# EasyEDA schematic SCH_Embedded Watch_2023-10-27.json
TITLE: Sheet_1; REV: 1.0; Date: 2023-04-10; Sheet: 1/1; Drawn By: Randle_H; Company: RandleH
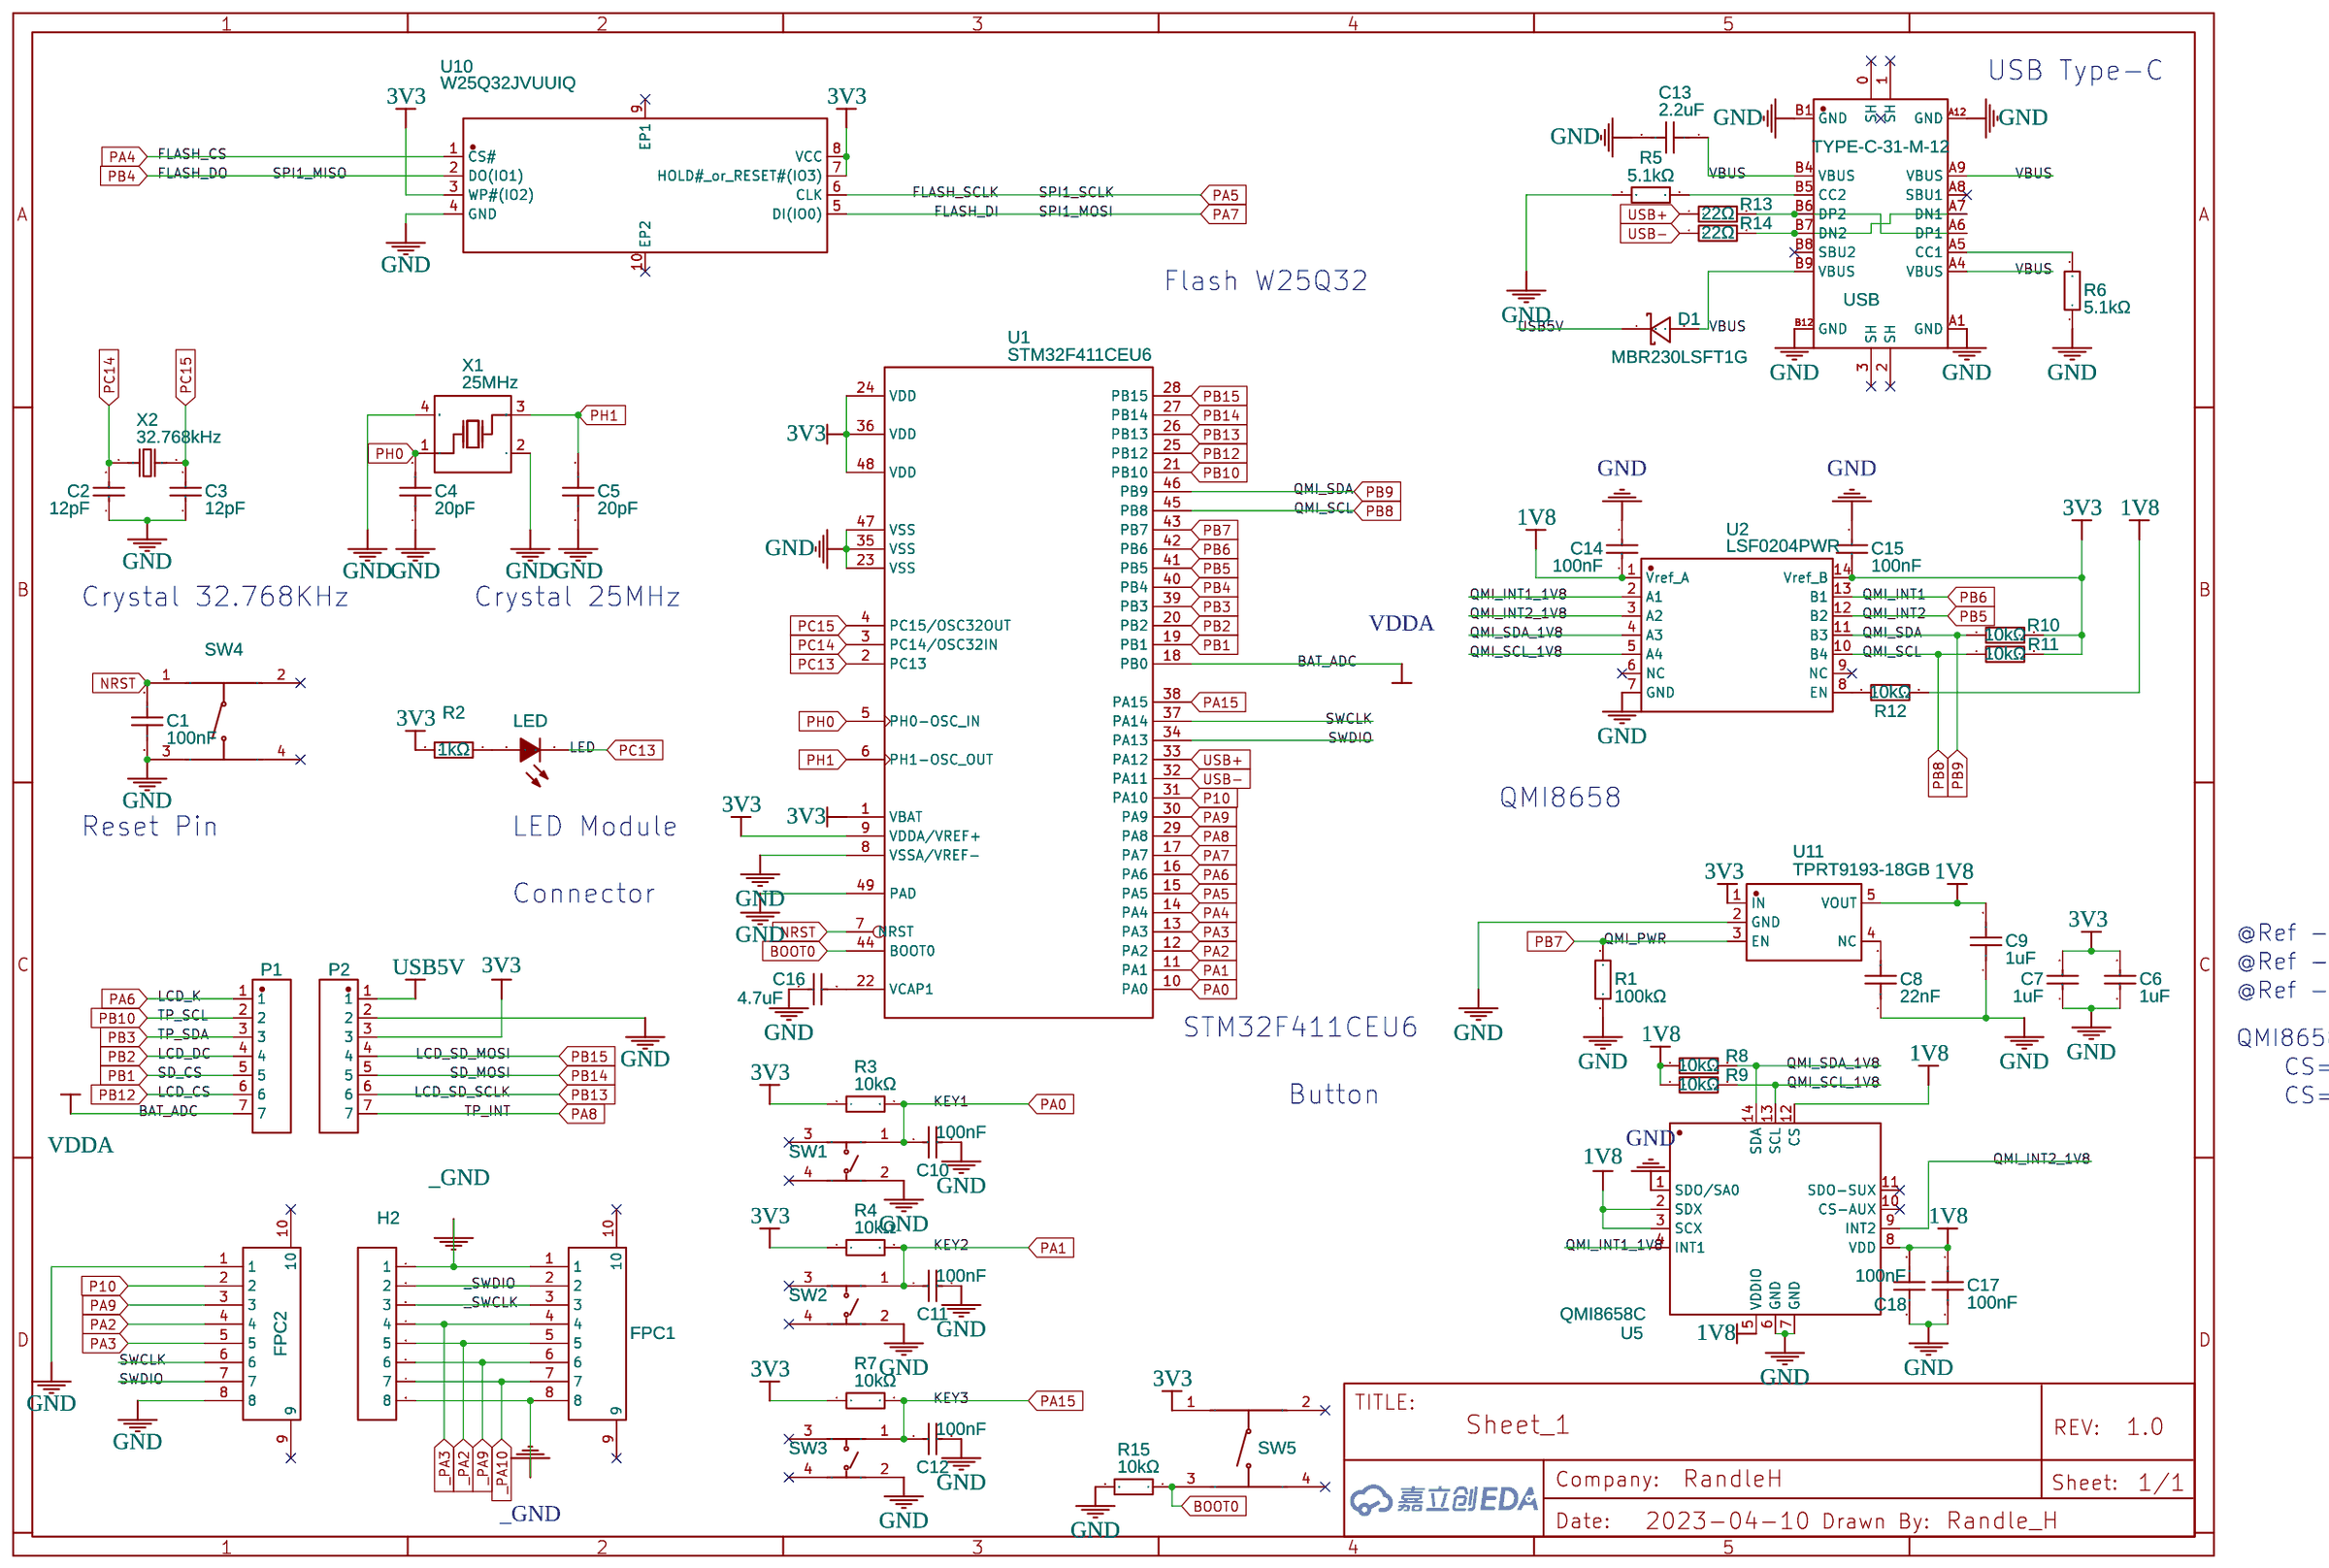
[diagram p0: schematic sheet]

## Parts
C1  100nF  [C0201]
C2  12pF  [C0201]
C3  12pF  [C0201]
C4  20pF  [C0201]
C5  20pF  [C0201]
C6  1uF  [C0201]
C7  1uF  [C0201]
C8  22nF  [C0201]
C9  1uF  [C0201]
C10  100nF  [C0402]
C11  100nF  [C0402]
C12  100nF  [C0402]
C13  2.2uF  [C0805]
C14  100nF  [C0402]
C15  100nF  [C0402]
C16  4.7uF  [C0402]
C17  100nF  [C0201]
C18  100nF  [C0201]
D1  MBR230LSFT1G  [SOD-123FL_L2.7-W1.8-LS3.8-RD]
FPC1  AFC01-S08FCA-00  [FPC-SMD_P0.50-8P_FGS-XJ-H2.0]
FPC2  AFC01-S08FCA-00  [FPC-SMD_P0.50-8P_FGS-XJ-H2.0]
H2  HDR-F-2.54_1x8  [HDR-F-2.54_1X8]
LED  19-213/Y2C-CQ2R2L/3T(CY)  [LED0603-RD-YELLOW]
P1  PM2.54-1*7  [HDR-SMD_7P-P2.54-V-M-LS4.8_R1]
P2  PM2.54-1*7  [HDR-SMD_7P-P2.54-V-M-LS4.8_R1]
R1  100kΩ  [R0402]
R2  1kΩ  [R0402]
R3  10kΩ  [R0402]
R4  10kΩ  [R0402]
R5  5.1kΩ  [R0402]
R6  5.1kΩ  [R0402]
R7  10kΩ  [R0402]
R8  10kΩ  [R0201]
R9  10kΩ  [R0201]
R10  10kΩ  [R0402]
R11  10kΩ  [R0402]
R12  10kΩ  [R0402]
R13  22Ω  [R0402]
R14  22Ω  [R0402]
R15  10kΩ  [R0402]
SW1  EVQPUD02K  [SW-SMD_EVQPUD02K-1]
SW2  EVQPUD02K  [SW-SMD_EVQPUD02K-1]
SW3  EVQPUD02K  [SW-SMD_EVQPUD02K-1]
SW4  PTS830GM140SMTRLFS  [KEY-SMD_4P-L3.0-W2.6-P1.80-LS3.5]
SW5  PTS830GM140SMTRLFS  [KEY-SMD_4P-L3.0-W2.6-P1.80-LS3.5]
U1  STM32F411CEU6  [UFQFPN-48_L7.0-W7.0-P0.50-BL-EP]
U2  LSF0204PWR  [TSSOP-14_L5.0-W4.4-P0.65-LS6.4-BL]
U5  QMI8658C  [LGA-14_L3.0-W2.5-P0.50-BR]
U10  W25Q32JVUUIQ  [USON-8_L4.0-W3.0-P0.80-BL_WINBOND_UU]
U11  TPRT9193-18GB  [SOT-23-5_L3.0-W1.7-P0.95-LS2.8-BL]
USB  TYPE-C-31-M-12  [USB-C_SMD-TYPE-C-31-M-12]
X1  25MHz  [OSC-SMD_4P-L3.2-W2.5-BL]
X2  32.768kHz  [FC-135R_L3.2-W1.5]

## Library data of the parts
C1 = CL05B104KB54PNC: Supplier: LCSC; Supplier Part: C307331; Manufacturer: SAMSUNG(三星); Contributor: LCSC; JLCPCB Part Class: Basic Part
C2 C3 = GRM0335C1H120GA01D: Contributor: LCSC; Supplier: LCSC; Supplier Part: C161404; Manufacturer: muRata(村田); JLCPCB Part Class: Extended Part; link: https://lcsc.com/eda_search?q=C161404&%26type=1&ref=editor
C4 C5 = GRM0335C1H200GA01D: Contributor: LCSC; Supplier: LCSC; Supplier Part: C384973; Manufacturer: muRata(村田); link: https://lcsc.com/eda_search?q=C384973&%26type=1&ref=editor
C6 C7 = GRM033R61A105ME44D: Supplier: LCSC; Manufacturer: muRata(村田); Supplier Part: C76935; JLCPCB Part Class: Extended Part; link: https://lcsc.com/eda_search?q=C76935&%26type=1&ref=editor
C8 = 0201X223K160NT: Contributor: LCSC; Supplier: LCSC; Supplier Part: C285066; Manufacturer: FH(风华); JLCPCB Part Class: Extended Part; link: https://lcsc.com/eda_search?q=C285066&%26type=1&ref=editor
C9 = JMK063ABJ105MP-F: Supplier: LCSC; Manufacturer: TAIYO YUDEN(太诱); Supplier Part: C87143; JLCPCB Part Class: Extended Part; link: https://lcsc.com/eda_search?q=C87143&%26type=1&ref=editor
C10-C12 C14 C15 = CL05B104KO5NNNC: Supplier: LCSC; Manufacturer: SAMSUNG(三星); Supplier Part: C1525; JLCPCB Part Class: Basic Part; link: https://lcsc.com/eda_search?q=C1525&%26type=1&ref=editor
C13 = CL21A225KBQNNNE: Contributor: LCSC; Supplier: LCSC; Supplier Part: C377773; Manufacturer: SAMSUNG(三星); JLCPCB Part Class: Extended Part; link: https://lcsc.com/eda_search?q=C377773&%26type=1&ref=editor
C16 = CL05A475MP5NRNC: Supplier: LCSC; Manufacturer: SAMSUNG(三星); Supplier Part: C23733; JLCPCB Part Class: Basic Part; link: https://lcsc.com/eda_search?q=C23733&%26type=1&ref=editor
C17 C18 = CL03A104KQ3NNNC: Contributor: LCSC; Supplier: LCSC; Manufacturer: SAMSUNG(三星); Supplier Part: C160831; JLCPCB Part Class: Extended Part; link: https://lcsc.com/eda_search?q=C160831&%26type=1&ref=editor
D1 = MBR230LSFT1G: Supplier: LCSC; Manufacturer: onsemi(安森美); Contributor: LCSC; Supplier Part: C126673; JLCPCB Part Class: Extended Part
FPC1 FPC2 = AFC01-S08FCA-00: Contributor: LCSC; Supplier: LCSC; Supplier Part: C262657; Manufacturer: JS(钜硕电子); JLCPCB Part Class: Extended Part; link: https://lcsc.com/eda_search?q=C262657&%26type=1&ref=editor
H2 = HDR-F-2.54_1x8: Supplier Part: C225505; Supplier: LCSC; Contributor: LCEDA_Lib
LED = 19-213/Y2C-CQ2R2L/3T(CY): Supplier: LCSC; Manufacturer: EVERLIGHT(亿光); Supplier Part: C72038; JLCPCB Part Class: Basic Part; link: https://lcsc.com/eda_search?q=C72038&%26type=1&ref=editor
P1 P2 = PM2.54-1*7: Contributor: lcsc; Supplier: LCSC; Supplier Part: C2883804; Manufacturer: XKB Connectivity(中国星坤); Manufacturer Part: X6511WVS-07H-C60D48R1
R1 = 0402WGF1003TCE: Supplier: LCSC; Manufacturer: UNI-ROYAL(厚声); Supplier Part: C25741; JLCPCB Part Class: Basic Part; link: https://lcsc.com/eda_search?q=C25741&%26type=1&ref=editor
R2 = 0402WGF1001TCE: Supplier: LCSC; Manufacturer: UNI-ROYAL(厚声); Supplier Part: C11702; JLCPCB Part Class: Basic Part; link: https://lcsc.com/eda_search?q=C11702&%26type=1&ref=editor
R3 R4 R7 R10-R12 R15 = 0402WGF1002TCE: Supplier: LCSC; Manufacturer: UNI-ROYAL(厚声); Supplier Part: C25744; JLCPCB Part Class: Basic Part; link: https://lcsc.com/eda_search?q=C25744&%26type=1&ref=editor
R5 R6 = 0402WGF5101TCE: Supplier: LCSC; Manufacturer: UNI-ROYAL(厚声); Supplier Part: C25905; JLCPCB Part Class: Basic Part; link: https://lcsc.com/eda_search?q=C25905&%26type=1&ref=editor
R8 R9 = RC0201JR-0710KL: Supplier: LCSC; Manufacturer: YAGEO(国巨); Supplier Part: C138117; JLCPCB Part Class: Extended Part; link: https://lcsc.com/eda_search?q=C138117&%26type=1&ref=editor
R13 R14 = 0402WGF220JTCE: Supplier: LCSC; Manufacturer: UNI-ROYAL(厚声); Supplier Part: C25092; JLCPCB Part Class: Basic Part; link: https://lcsc.com/eda_search?q=C25092&%26type=1&ref=editor
SW1-SW3 = EVQPUD02K: Supplier: LCSC; Supplier Part: C388885; Manufacturer: PANASONIC(松下); Contributor: LCSC; JLCPCB Part Class: Extended Part
SW4 SW5 = PTS830GM140SMTRLFS: Supplier: LCSC; Supplier Part: C221904; Manufacturer: C&K; Contributor: LCSC; JLCPCB Part Class: Extended Part
U1 = STM32F411CEU6: Supplier: LCSC; Manufacturer: ST(意法半导体); Supplier Part: C60420; JLCPCB Part Class: Extended Part
U2 = LSF0204PWR: Supplier: LCSC; Supplier Part: C202288; Manufacturer: TI(德州仪器); Contributor: LCSC; JLCPCB Part Class: Extended Part
U5 = QMI8658C: Supplier: LCSC; Supplier Part: C2842151; Manufacturer: QST(上海矽睿); JLCPCB Part Class: Extended Part; Contributor: LCSC
U10 = W25Q32JVUUIQ: Supplier: LCSC; Supplier Part: C2999380; Manufacturer: WINBOND(华邦); link: https://atta.szlcsc.com/upload/public/pdf/source/20220419/71F2D20BDA1217995CECC027DED216BE.pdf; Contributor: lcsc; JLCPCB Part Class: Extended Part
U11 = TPRT9193-18GB: Supplier: LCSC; Supplier Part: C2835438; Manufacturer: TECH PUBLIC(台舟); Contributor: LCSC; JLCPCB Part Class: Extended Part
USB = TYPE-C-31-M-12: Supplier: LCSC; Supplier Part: C165948; Manufacturer: 韩国韩荣; Contributor: LCSC; JLCPCB Part Class: Extended Part
X1 = SMD-3225_4P25MHZ20PF10PPM-40&#126;+85℃: Supplier: LCSC; Supplier Part: C164045; Manufacturer: TAE(雅晶鑫); Manufacturer Part: TAXM25M4RLBCCT2T; Contributor: LCSC; JLCPCB Part Class: Extended Part
X2 = Q13FC1350000400: Supplier: LCSC; Manufacturer: EPSON(爱普生); Supplier Part: C32346; JLCPCB Part Class: Basic Part; link: https://lcsc.com/eda_search?q=C32346&%26type=1&ref=editor

## Nets
1V8: C9.2 C14.1 C17.1 C18.1 R8.1 R9.1 R12.2 U2.1(Vref_A) U5.2(SDX) U5.3(SCX) U5.5(VDDIO) U5.8(VDD) U5.12(CS) U11.5(VOUT)
3V3: C6.2 C7.2 C15.1 P2.3 R2.1 R3.1 R4.1 R7.1 R10.2 R11.2 SW5.1 U1.1(VBAT) U1.9(VDDA/VREF+) U1.24(VDD) U1.36(VDD) U1.48(VDD) U2.14(Vref_B) U10.3(WP#(IO2)) U10.7(HOLD# or RESET#(IO3)) U10.8(VCC) U11.1(IN)
GND: C1.1 C2.1 C3.1 C4.1 C5.1 C6.1 C7.1 C8.1 C9.1 C10.2 C11.2 C12.2 C13.2 C14.2 C15.2 C16.1 C17.2 C18.2 FPC2.1 FPC2.8 P2.2 R1.1 R5.2 R6.1 R15.2 SW1.2 SW2.2 SW3.2 SW4.3 U1.8(VSSA/VREF-) U1.23(VSS) U1.35(VSS) U1.47(VSS) U1.49(PAD) U2.7(GND) U5.1(SDO/SA0) U5.6(GND) U5.7(GND) U10.4(GND) U11.2(GND) USB.A1(GND) USB.A12(GND) USB.B1(GND) USB.B12(GND) X1.2(GND) X1.4(GND)
VBUS: C13.1 D1.2(A) USB.A4(VBUS) USB.A9(VBUS) USB.B4(VBUS) USB.B9(VBUS)
_GND: FPC1.1 FPC1.8 H2.1 H2.8
_PA2: FPC1.5 H2.5
_PA3: FPC1.4 H2.4
_PA9: FPC1.6 H2.6
_PA10: FPC1.7 H2.7
_SWCLK: FPC1.3 H2.3
_SWDIO: FPC1.2 H2.2
BAT_ADC: P1.7 U1.18(PB0)
BOOT0: R15.1 SW5.3 U1.44(BOOT0)
FLASH_CS: U1.14(PA4) U10.1(CS#)
FLASH_DI: U1.17(PA7) U10.5(DI(IO0))
FLASH_DO: U1.40(PB4) U10.2(DO(IO1))
FLASH_SCLK: U1.15(PA5) U10.6(CLK)
KEY1: C10.1 R3.2 SW1.1 U1.10(PA0)
KEY2: C11.1 R4.2 SW2.1 U1.11(PA1)
KEY3: C12.1 R7.2 SW3.1 U1.38(PA15)
LCD_CS: P1.6 U1.25(PB12)
LCD_DC: P1.4 U1.20(PB2)
LCD_K: P1.1 U1.16(PA6)
LCD_SD_MOSI: P2.4 U1.28(PB15)
LCD_SD_SCLK: P2.6 U1.26(PB13)
LED: LED.1(C) U1.2(PC13)
NRST: C1.2 SW4.1 U1.7(NRST)
P10: FPC2.2 U1.31(PA10)
PA2: FPC2.4 U1.12(PA2)
PA3: FPC2.5 U1.13(PA3)
PA8: P2.7 U1.29(PA8)
PA9: FPC2.3 U1.30(PA9)
PB1: P1.5 U1.19(PB1)
PB3: P1.3 U1.39(PB3)
PB5: U1.41(PB5) U2.12(B2)
PB6: U1.42(PB6) U2.13(B1)
PB7: R1.2 U1.43(PB7) U11.3(EN)
PB8: R11.1 U1.45(PB8) U2.10(B4)
PB9: R10.1 U1.46(PB9) U2.11(B3)
PB10: P1.2 U1.21(PB10)
PB14: P2.5 U1.27(PB14)
PC14: C2.2 U1.3(PC14/OSC32IN) X2.1
PC15: C3.2 U1.4(PC15/OSC32OUT) X2.2
PH0: C4.2 U1.5(PH0-OSC_IN) X1.1(OSC1)
PH1: C5.2 U1.6(PH1-OSC_OUT) X1.3(OSC2)
QMI_INT1_1V8: U2.2(A1) U5.4(INT1)
QMI_INT2_1V8: U2.3(A2) U5.9(INT2)
QMI_SCL_1V8: R9.2 U2.5(A4) U5.13(SCL)
QMI_SDA_1V8: R8.2 U2.4(A3) U5.14(SDA)
SWCLK: FPC2.6 U1.37(PA14)
SWDIO: FPC2.7 U1.34(PA13)
USB5V: D1.1(C) P2.1
USB+: R13.1 U1.33(PA12)
USB-: R14.1 U1.32(PA11)
Net-(C8-2): C8.2 U11.4(NC)
Net-(C16-2): C16.2 U1.22(VCAP1)
Net-(LED-2): LED.2(A) R2.2
Net-(R5-1): R5.1 USB.B5(CC2)
Net-(R6-2): R6.2 USB.A5(CC1)
Net-(R12-1): R12.1 U2.8(EN)
Net-(R13-2): R13.2 USB.A6(DP1) USB.B6(DP2)
Net-(R14-2): R14.2 USB.A7(DN1) USB.B7(DN2)

Not connected (* = marked no-connect by the designer): FPC1 9* 10*; FPC2 9* 10*; SW1 3* 4*; SW2 3* 4*; SW3 3* 4*; SW4 2* 4*; SW5 2* 4*; U2 6(NC)* 9(NC)*; U5 10(CS-AUX)* 11(SDO-SUX)*; U10 9(EP1)* 10(EP2)*; USB 0(SH)* 1(SH)* 2(SH)* 3(SH)* A8(SBU1)* B8(SBU2)*

## Notes on the sheet
- USB Type-C
- Flash W25Q32
- Crystal 32.768KHz
- Crystal 25MHz
- QMI8658
- Reset Pin
- LED Module
- Connector
- @Ref - USB Type-C - Datasheet Table 3-11 USB2.0 Type-C Standard Cable
- @Ref - Reset Pin -  STM32 Datasheet Figure 32
- @Ref - Flash W25 - Datasheet Page 5
- STM32F411CEU6
- QMI8658C
- CS=0 SPI mode
- Pin1=SDO MISO
- Button
- CS=1 I2C mode
- Pin1=SA0 LSB address
